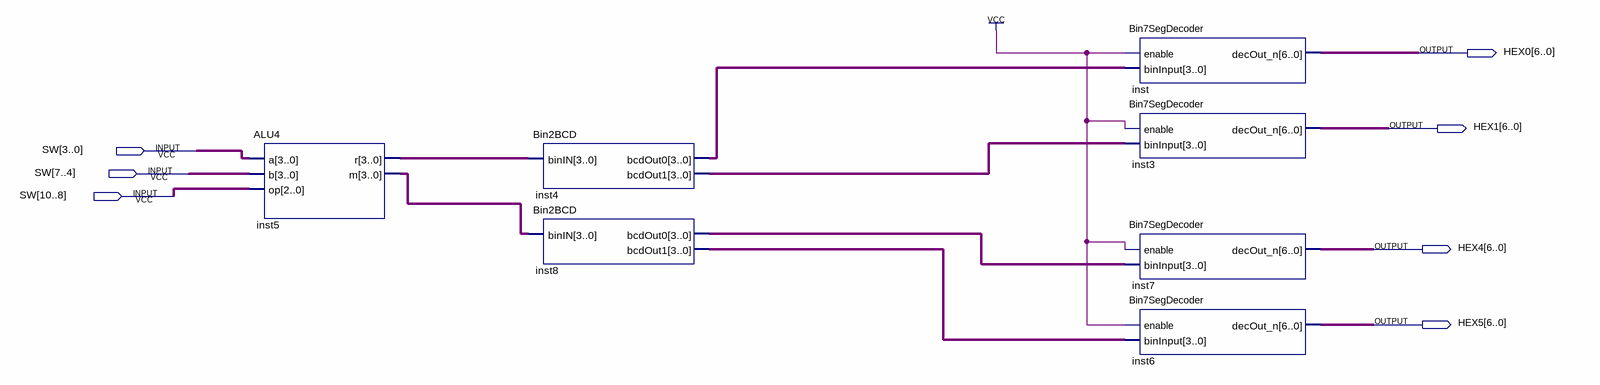
[diagram p0: schematic sheet]
// Quartus schematic Projeto.bdf as structural Verilog: 7 symbols, 7 pins
module Projeto (
  input  [10:0] SW,
  output [6:0] HEX0,
  output [6:0] HEX1,
  output [6:0] HEX4,
  output [6:0] HEX5
);

  wire [3:0] inst4_bcdout0, inst4_bcdout1, inst5_m, inst5_r, inst8_bcdout0, inst8_bcdout1;

  ALU4 inst5 (.a(SW[3:0]), .b(SW[7:4]), .op(SW[10:8]), .r(inst5_r), .m(inst5_m));
  Bin2BCD inst4 (.binIN(inst5_r), .bcdOut0(inst4_bcdout0), .bcdOut1(inst4_bcdout1));
  Bin2BCD inst8 (.binIN(inst5_m), .bcdOut0(inst8_bcdout0), .bcdOut1(inst8_bcdout1));
  Bin7SegDecoder inst (.enable(1'b1), .binInput(inst4_bcdout0), .decOut_n(HEX0));
  Bin7SegDecoder inst3 (.enable(1'b1), .binInput(inst4_bcdout1), .decOut_n(HEX1));
  Bin7SegDecoder inst7 (.enable(1'b1), .binInput(inst8_bcdout0), .decOut_n(HEX4));
  Bin7SegDecoder inst6 (.enable(1'b1), .binInput(inst8_bcdout1), .decOut_n(HEX5));
endmodule
